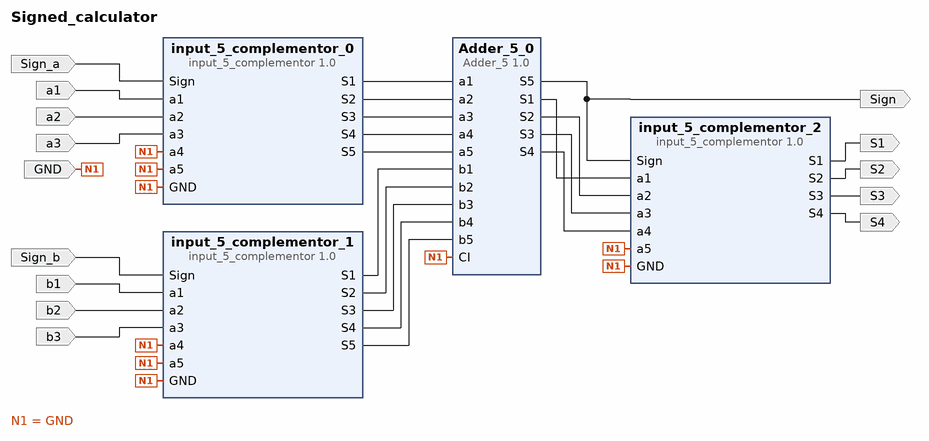
[diagram p0: block diagram of the top level]
# Vivado block design Signed_calculator, xc7a35tcpg236-1, Vivado 2021.1
create_bd_design Signed_calculator

create_bd_port -dir I Sign_a
create_bd_port -dir I a1
create_bd_port -dir I a2
create_bd_port -dir I a3
create_bd_port -dir I Sign_b
create_bd_port -dir I GND
create_bd_port -dir I b1
create_bd_port -dir I b2
create_bd_port -dir I b3
create_bd_port -dir O S1
create_bd_port -dir O S2
create_bd_port -dir O S3
create_bd_port -dir O S4
create_bd_port -dir O Sign

create_bd_cell -type ip -vlnv xilinx.com:user:input_5_complementor:1.0 input_5_complementor_0
create_bd_cell -type ip -vlnv xilinx.com:user:input_5_complementor:1.0 input_5_complementor_1
create_bd_cell -type ip -vlnv xilinx.com:user:input_5_complementor:1.0 input_5_complementor_2
create_bd_cell -type ip -vlnv xilinx.com:user:Adder_5:1.0 Adder_5_0

# ---- connections ----

connect_bd_net -net Adder_4_0_CO [get_bd_pins Adder_5_0/S5] [get_bd_pins input_5_complementor_2/Sign] [get_bd_ports Sign]
connect_bd_net -net Adder_4_0_S1 [get_bd_pins Adder_5_0/S1] [get_bd_pins input_5_complementor_2/a1]
connect_bd_net -net Adder_4_0_S2 [get_bd_pins Adder_5_0/S2] [get_bd_pins input_5_complementor_2/a2]
connect_bd_net -net Adder_4_0_S3 [get_bd_pins Adder_5_0/S3] [get_bd_pins input_5_complementor_2/a3]
connect_bd_net -net Adder_4_0_S4 [get_bd_pins Adder_5_0/S4] [get_bd_pins input_5_complementor_2/a4]
connect_bd_net [get_bd_ports GND] \
  [get_bd_pins input_5_complementor_0/a4] [get_bd_pins input_5_complementor_0/a5] [get_bd_pins input_5_complementor_1/a4] \
  [get_bd_pins input_5_complementor_1/a5] [get_bd_pins input_5_complementor_1/GND] [get_bd_pins input_5_complementor_0/GND] \
  [get_bd_pins input_5_complementor_2/a5] [get_bd_pins input_5_complementor_2/GND] [get_bd_pins Adder_5_0/CI]
connect_bd_net [get_bd_ports Sign_a] [get_bd_pins input_5_complementor_0/Sign]
connect_bd_net [get_bd_ports Sign_b] [get_bd_pins input_5_complementor_1/Sign]
connect_bd_net -net a1_1 [get_bd_ports a1] [get_bd_pins input_5_complementor_0/a1]
connect_bd_net -net a2_1 [get_bd_ports a2] [get_bd_pins input_5_complementor_0/a2]
connect_bd_net -net a3_1 [get_bd_ports a3] [get_bd_pins input_5_complementor_0/a3]
connect_bd_net -net b1_1 [get_bd_ports b1] [get_bd_pins input_5_complementor_1/a1]
connect_bd_net -net b2_1 [get_bd_ports b2] [get_bd_pins input_5_complementor_1/a2]
connect_bd_net -net b3_1 [get_bd_ports b3] [get_bd_pins input_5_complementor_1/a3]
connect_bd_net [get_bd_pins input_5_complementor_0/S1] [get_bd_pins Adder_5_0/a1]
connect_bd_net [get_bd_pins input_5_complementor_0/S2] [get_bd_pins Adder_5_0/a2]
connect_bd_net [get_bd_pins input_5_complementor_0/S3] [get_bd_pins Adder_5_0/a3]
connect_bd_net [get_bd_pins input_5_complementor_0/S4] [get_bd_pins Adder_5_0/a4]
connect_bd_net [get_bd_pins input_5_complementor_0/S5] [get_bd_pins Adder_5_0/a5]
connect_bd_net [get_bd_pins input_5_complementor_1/S1] [get_bd_pins Adder_5_0/b1]
connect_bd_net [get_bd_pins input_5_complementor_1/S2] [get_bd_pins Adder_5_0/b2]
connect_bd_net [get_bd_pins input_5_complementor_1/S3] [get_bd_pins Adder_5_0/b3]
connect_bd_net [get_bd_pins input_5_complementor_1/S4] [get_bd_pins Adder_5_0/b4]
connect_bd_net [get_bd_pins input_5_complementor_1/S5] [get_bd_pins Adder_5_0/b5]
connect_bd_net [get_bd_pins input_5_complementor_2/S1] [get_bd_ports S1]
connect_bd_net [get_bd_pins input_5_complementor_2/S2] [get_bd_ports S2]
connect_bd_net [get_bd_pins input_5_complementor_2/S3] [get_bd_ports S3]
connect_bd_net [get_bd_pins input_5_complementor_2/S4] [get_bd_ports S4]

validate_bd_design
save_bd_design
